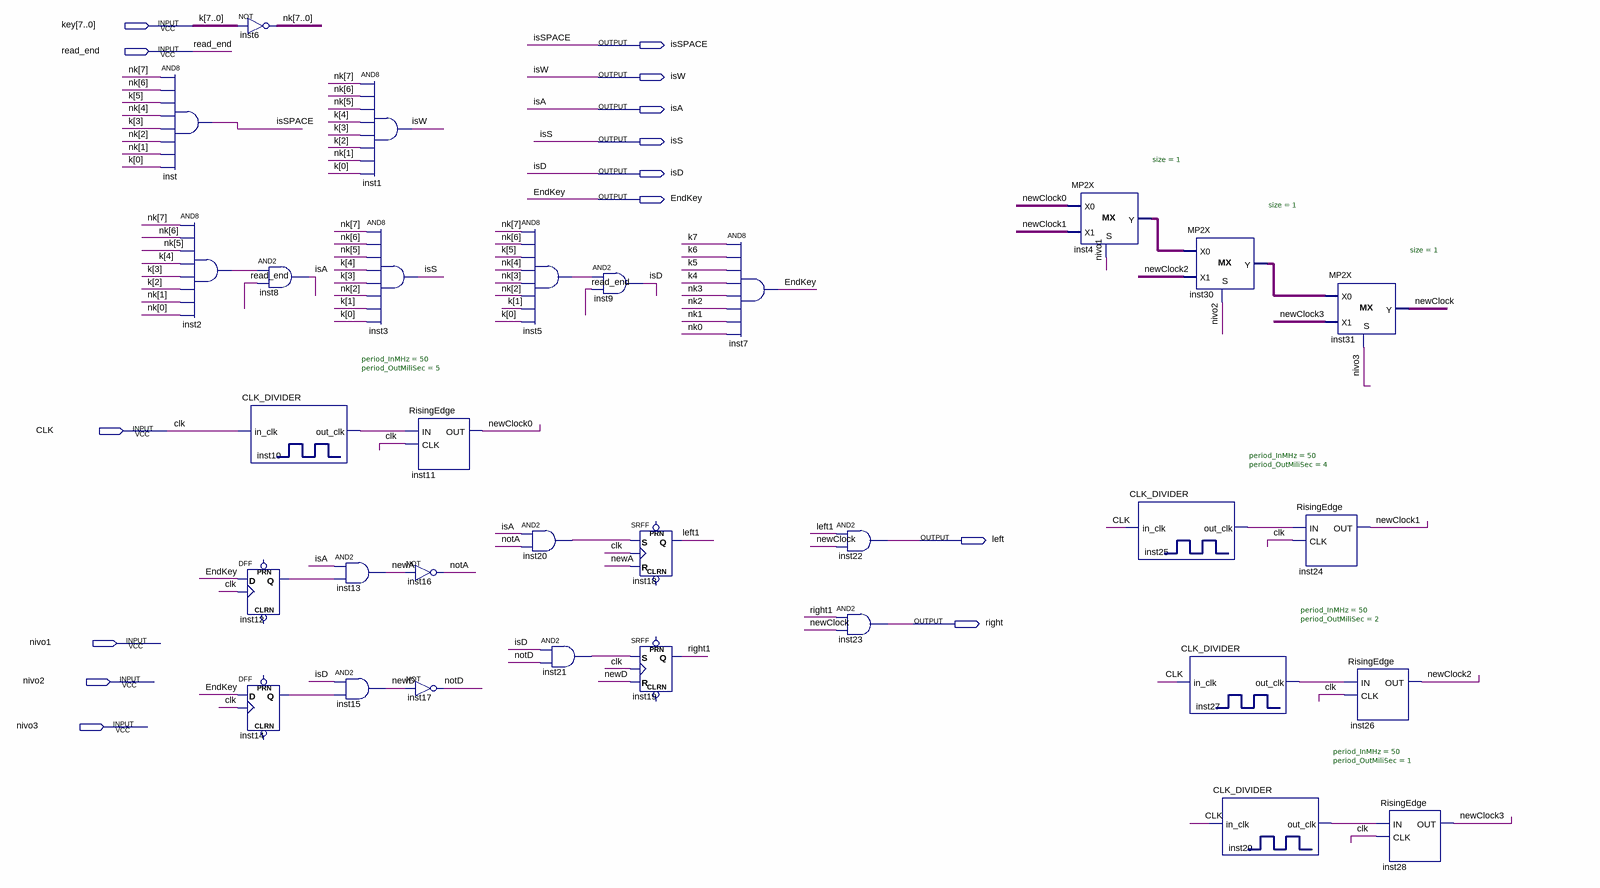
[diagram p0: schematic sheet]
// Quartus schematic KeyDetector.bdf as structural Verilog: 32 symbols, 14 pins
module KeyDetector (
  input  [7:0] key,
  input  read_end,
  input  CLK,
  input  nivo1,
  input  nivo2,
  input  nivo3,
  output isSPACE,
  output isW,
  output isA,
  output isS,
  output isD,
  output EndKey,
  output left,
  output right
);

  wire inst2_out, inst4_y, inst5_out, inst10_out_clk, inst12_q, inst14_q, inst20_out, inst21_out,
       inst25_out_clk, inst27_out_clk, inst29_out_clk, inst30_y, left1, newA, newClock, newClock0, newClock1,
       newClock2, newClock3, newD, notA, notD, right1;
  wire [7:0] nk;

  and inst (isSPACE, nk[7], nk[6], key[5], nk[4], key[3], nk[2], nk[1], key[0]);
  and inst2 (inst2_out, nk[7], nk[6], nk[5], key[4], key[3], key[2], nk[1], nk[0]);
  assign nk = ~key;  // NOT inst6, 8 bits wide
  and inst8 (isA, inst2_out, read_end);
  CLK_DIVIDER #(.period_InMHz(50), .period_OutMiliSec(5)) inst10 (.in_clk(CLK), .out_clk(inst10_out_clk));
  DFF inst12 (.CLK(CLK), .D(EndKey), .Q(inst12_q));  // open: CLRN, PRN
  DFF inst14 (.CLK(CLK), .D(EndKey), .Q(inst14_q));  // open: CLRN, PRN
  and inst1 (isW, nk[7], nk[6], nk[5], key[4], key[3], key[2], nk[1], key[0]);
  and inst3 (isS, nk[7], nk[6], nk[5], key[4], key[3], nk[2], key[1], key[0]);
  and inst13 (newA, isA, inst12_q);
  and inst15 (newD, isD, inst14_q);
  RisingEdge inst11 (.IN(inst10_out_clk), .CLK(CLK), .OUT(newClock0));
  not inst16 (notA, newA);
  not inst17 (notD, newD);
  and inst5 (inst5_out, nk[7], nk[6], key[5], nk[4], nk[3], nk[2], key[1], key[0]);
  and inst20 (inst20_out, isA, notA);
  and inst21 (inst21_out, isD, notD);
  and inst9 (isD, inst5_out, read_end);
  SRFF inst18 (.S(inst20_out), .R(newA), .CLK(CLK), .Q(left1));  // open: PRN, CLRN
  SRFF inst19 (.S(inst21_out), .R(newD), .CLK(CLK), .Q(right1));  // open: PRN, CLRN
  and inst7 (EndKey, key[7], key[6], key[5], key[4], nk[3], nk[2], nk[1], nk[0]);
  and inst22 (left, left1, newClock);
  and inst23 (right, right1, newClock);
  MP2X #(.size(1)) inst4 (.S(nivo1), .X0(newClock0), .X1(newClock1), .Y(inst4_y));
  CLK_DIVIDER #(.period_InMHz(50), .period_OutMiliSec(4)) inst25 (.in_clk(CLK), .out_clk(inst25_out_clk));
  MP2X #(.size(1)) inst30 (.S(nivo2), .X0(inst4_y), .X1(newClock2), .Y(inst30_y));
  CLK_DIVIDER #(.period_InMHz(50), .period_OutMiliSec(2)) inst27 (.in_clk(CLK), .out_clk(inst27_out_clk));
  CLK_DIVIDER #(.period_InMHz(50), .period_OutMiliSec(1)) inst29 (.in_clk(CLK), .out_clk(inst29_out_clk));
  RisingEdge inst24 (.IN(inst25_out_clk), .CLK(CLK), .OUT(newClock1));
  MP2X #(.size(1)) inst31 (.S(nivo3), .X0(inst30_y), .X1(newClock3), .Y(newClock));
  RisingEdge inst26 (.IN(inst27_out_clk), .CLK(CLK), .OUT(newClock2));
  RisingEdge inst28 (.IN(inst29_out_clk), .CLK(CLK), .OUT(newClock3));

  // Other names for the same wires on the sheet: k[7:0] = key; k4 = key[4]; k5 = key[5]; k6 = key[6]; k7 = key[7]
endmodule
